# Altium schematic sheet 覆铜板转接.SchDoc
size A4
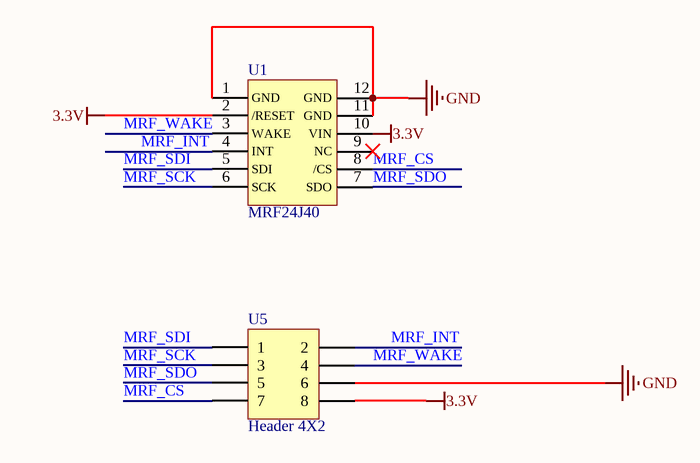
[diagram p0: 覆铜板转接.SchDoc]

## Parts
U1  MRF24J40  [MRF24J40]
U5  Header 4X2  [HDR2X4]

## Nets
3.3V: U1.2(/RESET) U1.10(VIN) U5.8
GND: U1.1(GND) U1.11(GND) U1.12(GND) U5.6
MRF_CS: U1.8(/CS) U5.7
MRF_INT: U1.4(INT) U5.2
MRF_SCK: U1.6(SCK) U5.3
MRF_SDI: U1.5(SDI) U5.1
MRF_SDO: U1.7(SDO) U5.5
MRF_WAKE: U1.3(WAKE) U5.4

Not connected (* = marked no-connect by the designer): U1 9(NC)*

## Library data of the parts
U5 = Header 4X2: Header, 4-Pin, Dual row; LatestRevisionDate: 17-Jul-2002; LatestRevisionNote: Re-released for DXP Platform.; Publisher: Altium Limited